# Altium schematic sheet Page01 COVER.SchDoc
size 513 x 386 mm
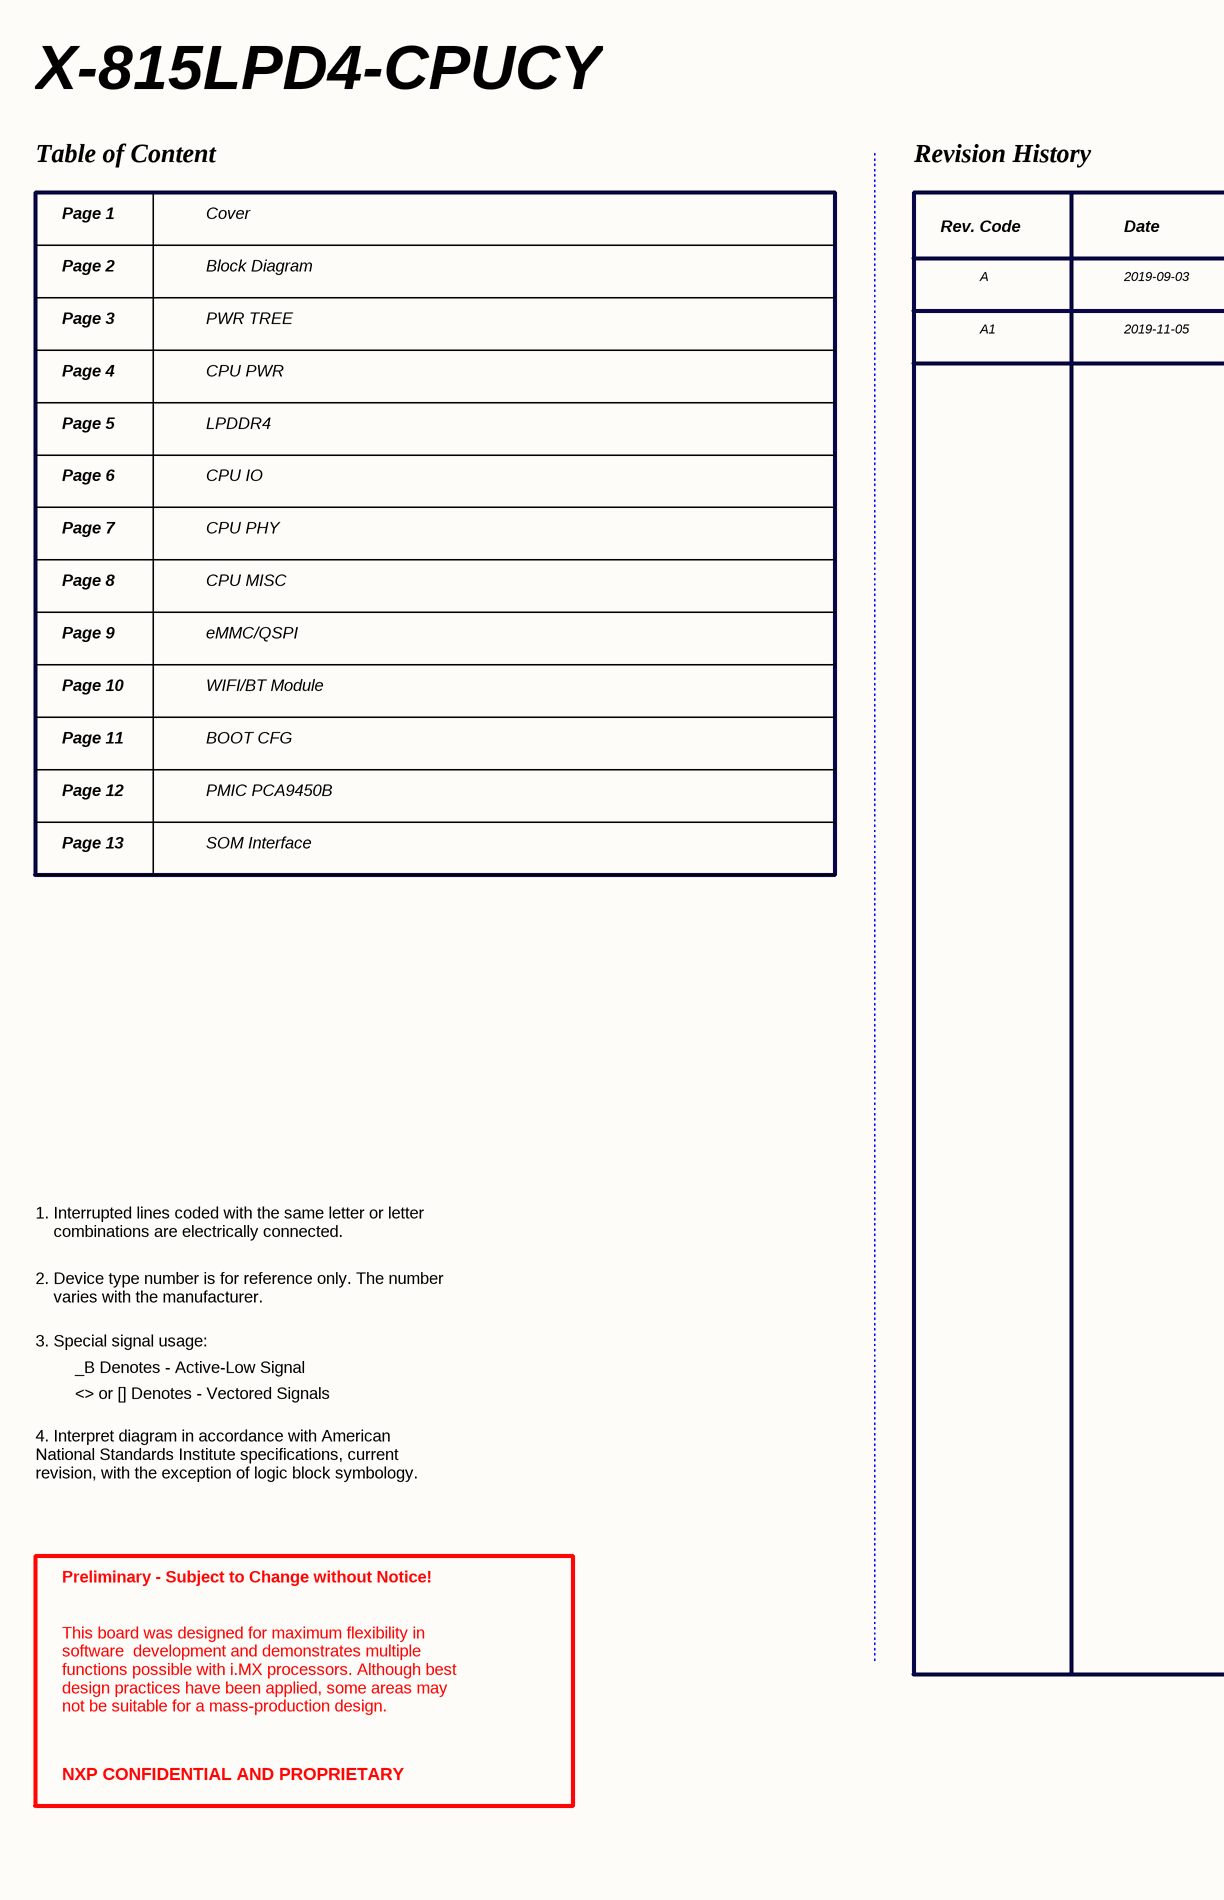
[diagram p0: Page01 COVER.SchDoc, left]
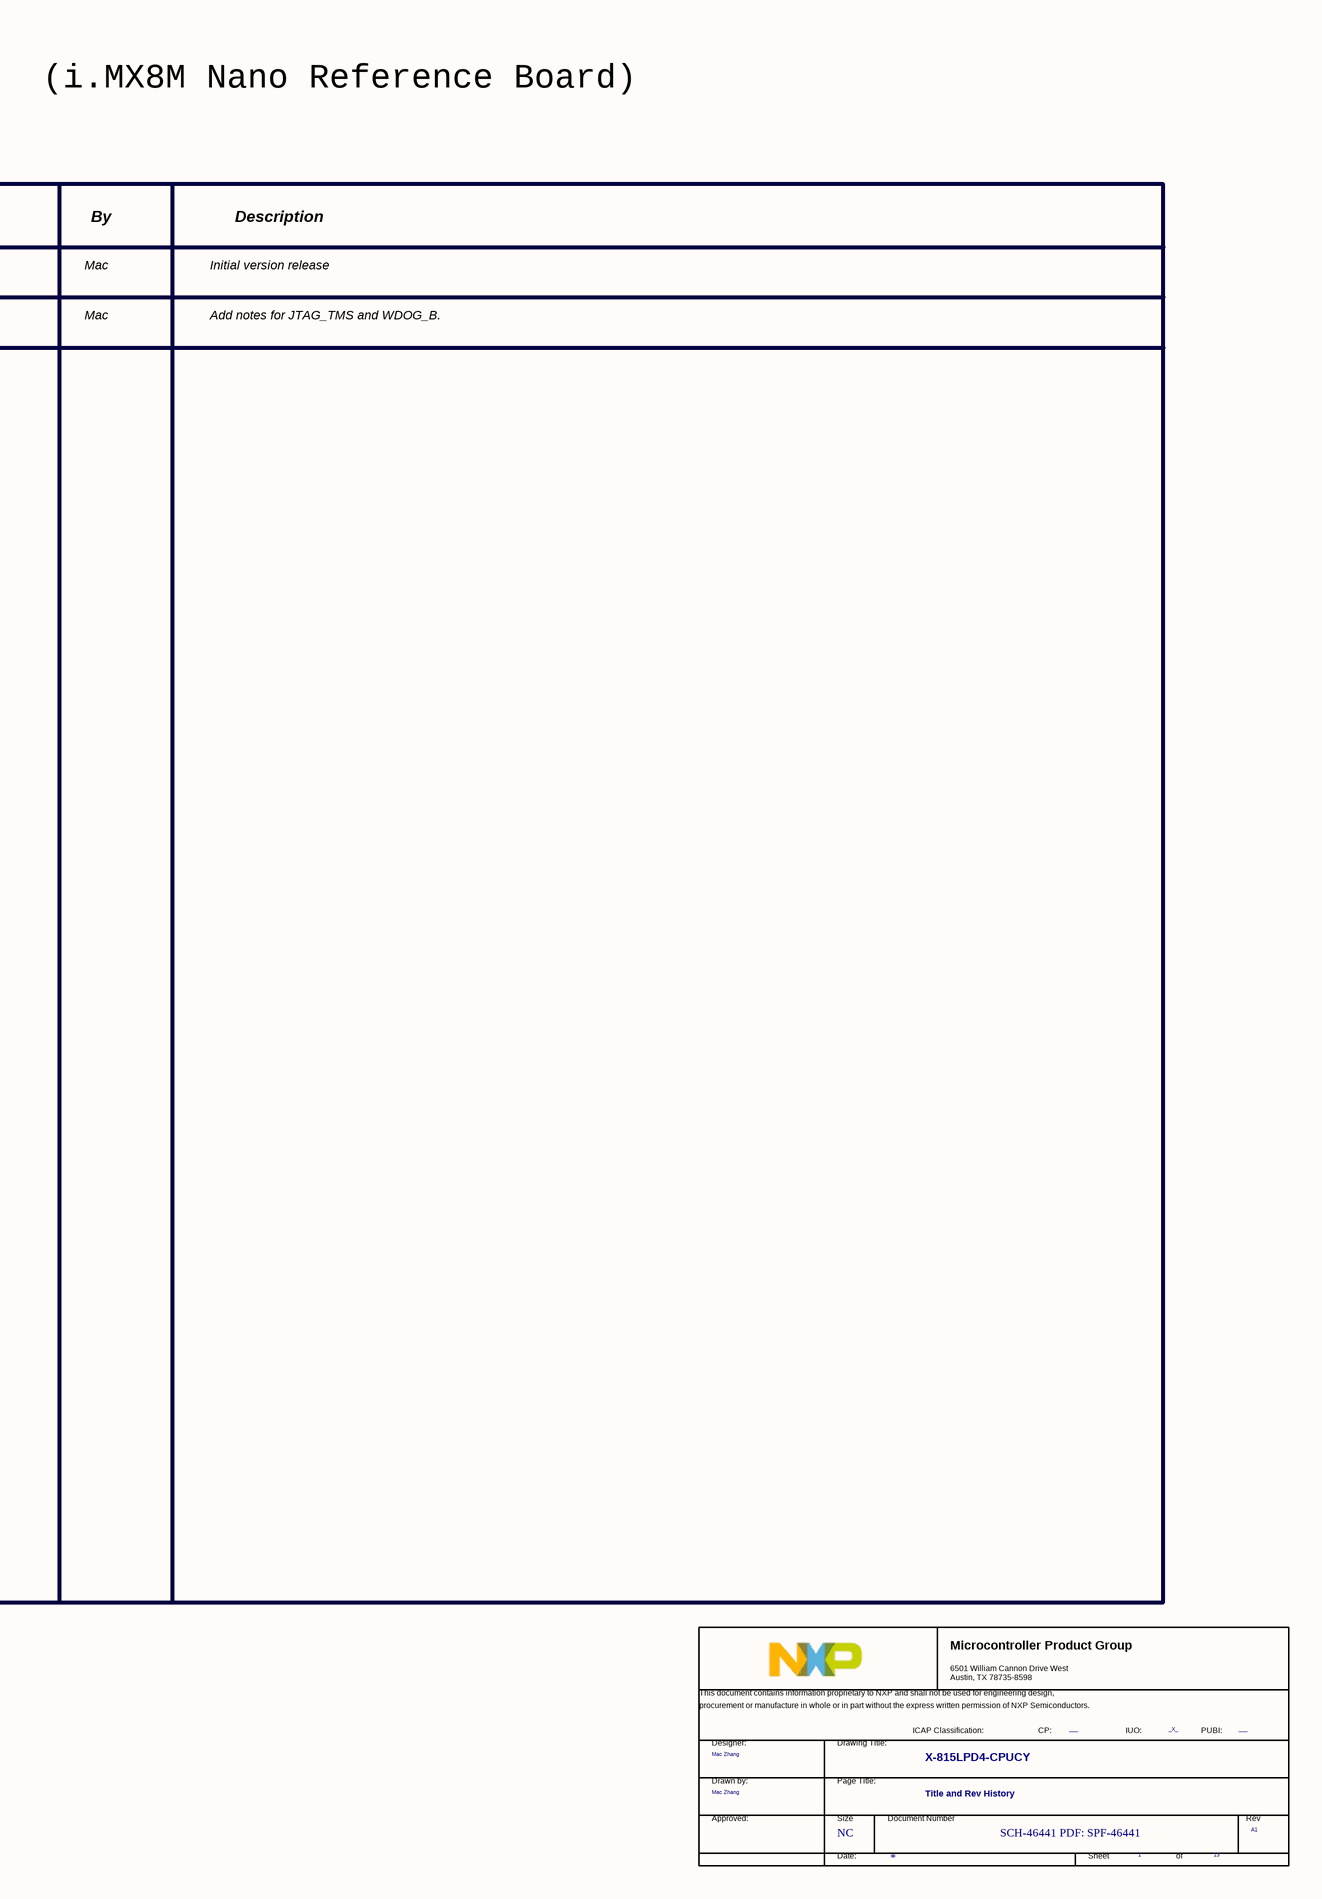
[diagram p1: Page01 COVER.SchDoc, right]

## Parts
*  Doc: SCH-46441 PDF: SPF-46441  RevCode: A1  Title: X-815LPD4-CPUCY  Page Size: NC  Page Number: 1  Page Count: 13  PageTitle: Title and Rev History  Designer: Mac Zhang  PUBI: ___  FIUO: _X_  (hidden comment: TitleBlock_MCPG)  (graphical)

## Notes on the sheet
- X-815LPD4-CPUCY
- (i.MX8M Nano Reference Board)
- Table of Content
- Page 1
- Cover
- Revision History
- Page 2
- Block Diagram
- Rev. Code
- A
- Date
- 2019-09-03
- Mac
- By
- Initial version release
- Description
- Page 3
- PWR TREE
- A1
- 2019-11-05
- Add notes for JTAG_TMS and WDOG_B.
- Page 4
- CPU PWR
- Page 5
- Page 6
- LPDDR4
- CPU IO
- Page 7
- CPU PHY
- Page 8
- CPU MISC
- Page 9
- eMMC/QSPI
- Page 10
- Page 11
- BOOT CFG
- WIFI/BT Module
- Page 12
- PMIC PCA9450B
- Page 13
- SOM Interface
- 1. Interrupted lines coded with the same letter or letter
  combinations are electrically connected.
- 2. Device type number is for reference only. The number
  varies with the manufacturer.
- 3. Special signal usage:
- _B Denotes - Active-Low Signal
- <> or [] Denotes - Vectored Signals
- 4. Interpret diagram in accordance with American
  National Standards Institute specifications, current
  revision, with the exception of logic block symbology.
- Preliminary - Subject to Change without Notice!
- This board was designed for maximum flexibility in
  software  development and demonstrates multiple
  functions possible with i.MX processors. Although best
  design practices have been applied, some areas may
  not be suitable for a mass-production design.
- NXP CONFIDENTIAL AND PROPRIETARY
- (in symbol TitleBlock_MCPG) Microcontroller Product Group; 6501 William Cannon Drive West / Austin, TX 78735-8598; This document contains information proprietary to NXP and shall not be used for engineering design,; procurement or manufacture in whole or in part without the express written permission of NXP Semiconductors.; ICAP Classification:; CP:; IUO:; PUBI:; Designer:; Drawing Title:; Drawn by:; Page Title:; Approved:; Size; Document Number; Rev; Date:; Sheet; of

## Library data of the parts
* = TitleBlock_MCPG: OrgName: NXP Semiconductor; OrgAddr1: NO. 192 Liangjing Rd. Pudong New Area, ShangHai; Page Create Date: March  8, 1995; DrawnBy: Mac Zhang; FCP: ___; Page Modify Date: *